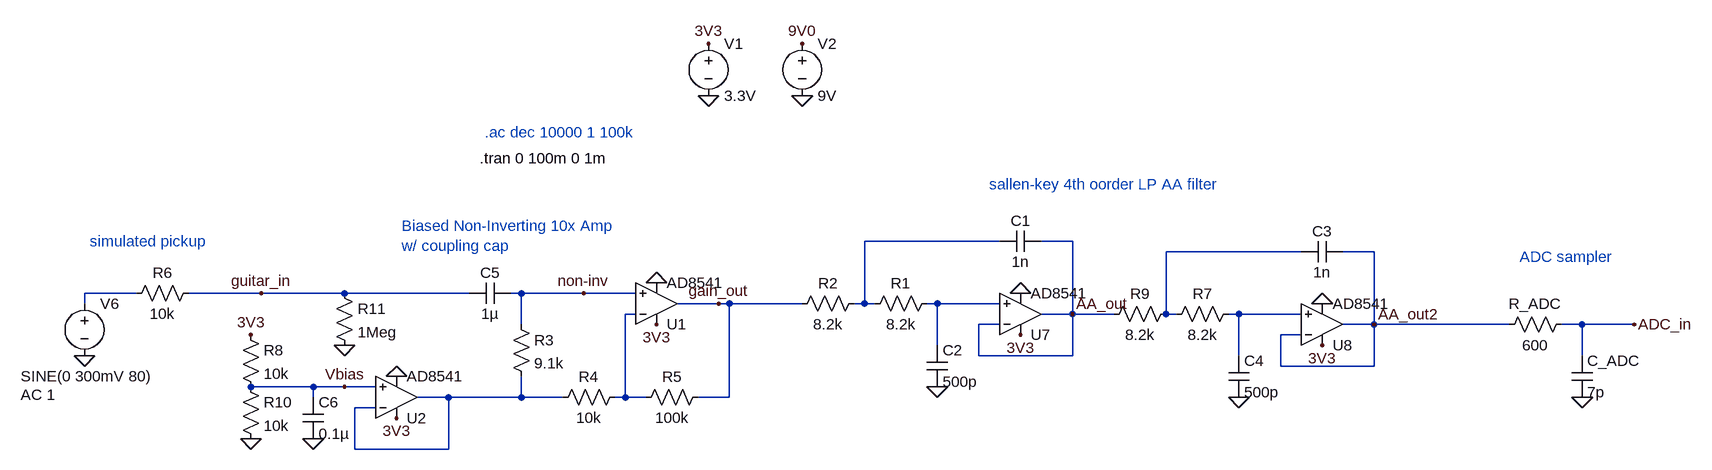
[diagram p0: schematic analog_rx.asc]
analog_rx.asc, the LTspice schematic file:
Version 4.1
SHEET 1 1668 1044
WIRE 304 96 96 96
WIRE 416 96 368 96
WIRE 768 112 560 112
WIRE 880 112 832 112
WIRE -1024 176 -1104 176
WIRE -832 176 -944 176
WIRE -704 176 -832 176
WIRE -512 176 -704 176
WIRE -432 176 -448 176
WIRE -336 176 -432 176
WIRE -256 176 -336 176
WIRE -1104 192 -1104 176
WIRE -128 192 -192 192
WIRE -112 192 -128 192
WIRE 0 192 -112 192
WIRE 96 192 96 96
WIRE 96 192 80 192
WIRE 112 192 96 192
WIRE 208 192 192 192
WIRE 304 192 208 192
WIRE -256 208 -272 208
WIRE 416 208 416 96
WIRE 416 208 368 208
WIRE 480 208 416 208
WIRE 560 208 560 112
WIRE 576 208 560 208
WIRE 672 208 656 208
WIRE 768 208 672 208
WIRE -432 224 -432 176
WIRE 304 224 272 224
WIRE 880 224 880 112
WIRE 880 224 832 224
WIRE 1088 224 880 224
WIRE 1200 224 1168 224
WIRE 1280 224 1200 224
WIRE 768 240 736 240
WIRE 208 256 208 192
WIRE 272 272 272 224
WIRE 416 272 416 208
WIRE 416 272 272 272
WIRE 672 272 672 208
WIRE 1200 272 1200 224
WIRE 736 288 736 240
WIRE 880 288 880 224
WIRE 880 288 736 288
WIRE -752 320 -848 320
WIRE -704 320 -752 320
WIRE -656 320 -704 320
WIRE -752 336 -752 320
WIRE -544 336 -592 336
WIRE -432 336 -432 304
WIRE -432 336 -544 336
WIRE -368 336 -432 336
WIRE -272 336 -272 208
WIRE -272 336 -288 336
WIRE -240 336 -272 336
WIRE -112 336 -112 192
WIRE -112 336 -160 336
WIRE -656 352 -688 352
WIRE -688 416 -688 352
WIRE -544 416 -544 336
WIRE -544 416 -688 416
FLAG 1200 336 0
FLAG 1280 224 ADC_in
FLAG 208 320 0
FLAG 0 -128 0
FLAG -144 -128 0
FLAG 416 208 AA_out
FLAG 336 240 3V3
FLAG 336 176 0
FLAG 0 -208 9V0
FLAG -144 -208 3V3
FLAG 672 336 0
FLAG 880 224 AA_out2
FLAG 800 256 3V3
FLAG 800 192 0
FLAG -128 192 gain_out
FLAG -224 224 3V3
FLAG -224 160 0
FLAG -832 176 guitar_in
FLAG -848 400 0
FLAG -1104 272 0
FLAG -704 320 Vbias
FLAG -848 240 3V3
FLAG -624 368 3V3
FLAG -624 304 0
FLAG -336 176 non-inv
FLAG -752 400 0
FLAG -704 256 0
SYMBOL res 1184 208 R90
WINDOW 0 0 56 VBottom 2
WINDOW 3 32 56 VTop 2
SYMATTR InstName R_ADC
SYMATTR Value 600
SYMBOL cap 1184 272 R0
SYMATTR InstName C_ADC
SYMATTR Value 7p
SYMBOL cap 368 80 R90
WINDOW 0 0 32 VBottom 2
WINDOW 3 32 32 VTop 2
SYMATTR InstName C1
SYMATTR Value 1n
SYMBOL res 208 176 R90
WINDOW 0 0 56 VBottom 2
WINDOW 3 32 56 VTop 2
SYMATTR InstName R1
SYMATTR Value 8.2k
SYMBOL res 96 176 R90
WINDOW 0 0 56 VBottom 2
WINDOW 3 32 56 VTop 2
SYMATTR InstName R2
SYMATTR Value 8.2k
SYMBOL cap 192 256 R0
SYMATTR InstName C2
SYMATTR Value 500p
SYMBOL voltage -144 -224 R0
SYMATTR InstName V1
SYMATTR Value 3.3V
SYMBOL voltage 0 -224 R0
SYMATTR InstName V2
SYMATTR Value 9V
SYMBOL cap 832 96 R90
WINDOW 0 0 32 VBottom 2
WINDOW 3 32 32 VTop 2
SYMATTR InstName C3
SYMATTR Value 1n
SYMBOL res 672 192 R90
WINDOW 0 0 56 VBottom 2
WINDOW 3 32 56 VTop 2
SYMATTR InstName R7
SYMATTR Value 8.2k
SYMBOL cap 656 272 R0
SYMATTR InstName C4
SYMATTR Value 500p
SYMBOL res 576 192 R90
WINDOW 0 0 56 VBottom 2
WINDOW 3 32 56 VTop 2
SYMATTR InstName R9
SYMATTR Value 8.2k
SYMBOL OpAmps\\AD8541 336 272 M180
SYMATTR InstName U7
SYMBOL OpAmps\\AD8541 800 288 M180
SYMATTR InstName U8
SYMBOL cap -448 160 R90
WINDOW 0 0 32 VBottom 2
WINDOW 3 32 32 VTop 2
SYMATTR InstName C5
SYMATTR Value 1µ
SYMBOL res -448 208 R0
SYMATTR InstName R3
SYMATTR Value 9.1k
SYMBOL res -272 320 R90
WINDOW 0 0 56 VBottom 2
WINDOW 3 32 56 VTop 2
SYMATTR InstName R4
SYMATTR Value 10k
SYMBOL res -144 320 R90
WINDOW 0 0 56 VBottom 2
WINDOW 3 32 56 VTop 2
SYMATTR InstName R5
SYMATTR Value 100k
SYMBOL voltage -1104 176 R0
WINDOW 3 -98 128 Left 2
WINDOW 123 -98 156 Left 2
WINDOW 39 0 0 Left 0
SYMATTR Value SINE(0 300mV 80)
SYMATTR Value2 AC 1
SYMATTR InstName V6
SYMBOL res -928 160 R90
WINDOW 0 0 56 VBottom 2
WINDOW 3 32 56 VTop 2
SYMATTR InstName R6
SYMATTR Value 10k
SYMBOL OpAmps\\AD8541 -224 256 M180
SYMATTR InstName U1
SYMBOL res -864 224 R0
SYMATTR InstName R8
SYMATTR Value 10k
SYMBOL res -864 304 R0
SYMATTR InstName R10
SYMATTR Value 10k
SYMBOL OpAmps\\AD8541 -624 400 M180
SYMATTR InstName U2
SYMBOL cap -768 336 R0
SYMATTR InstName C6
SYMATTR Value 0.1µ
SYMBOL res -720 160 R0
SYMATTR InstName R11
SYMATTR Value 1Meg
TEXT 288 8 Left 2 ;sallen-key 4th oorder LP AA filter
TEXT 1104 120 Left 2 ;ADC sampler
TEXT -488 -72 Left 2 ;.ac dec 10000 1 100k
TEXT -496 -32 Left 2 !.tran 0 100m 0 1m
TEXT -1096 96 Left 2 ;simulated pickup
TEXT -616 72 Left 2 ;Biased Non-Inverting 10x Amp\nw/ coupling cap

The netlist it stands for:
* analog_rx.asc
R_ADC ADC_in AA_out2 600
C_ADC ADC_in 0 7p
C1 AA_out N001 1n
R1 N004 N001 8.2k
R2 N001 gain_out 8.2k
C2 N004 0 500p
V1 3V3 0 3.3V
V2 9V0 0 9V
C3 AA_out2 N002 1n
R7 N006 N002 8.2k
C4 N006 0 500p
R9 N002 AA_out 8.2k
X§U7 N004 AA_out 3V3 0 AA_out AD8541  ; pins In+ In- V+ V- OUT
X§U8 N006 AA_out2 3V3 0 AA_out2 AD8541  ; pins In+ In- V+ V- OUT
C5 non-inv guitar_in 1µ
R3 non-inv N007 9.1k
R4 N005 N007 10k
R5 gain_out N005 100k
V6 N003 0 SINE(0 300mV 80) AC 1
R6 guitar_in N003 10k
X§U1 non-inv N005 3V3 0 gain_out AD8541  ; pins In+ In- V+ V- OUT
R8 3V3 Vbias 10k
R10 Vbias 0 10k
X§U2 Vbias N007 3V3 0 N007 AD8541  ; pins In+ In- V+ V- OUT
C6 Vbias 0 0.1µ
R11 guitar_in 0 1Meg
* sallen-key 4th oorder LP AA filter
* ADC sampler
* .ac dec 10000 1 100k
.tran 0 100m 0 1m
* simulated pickup
* Biased Non-Inverting 10x Amp
* w/ coupling cap
.backanno
.end